# EAGLE schematic Kord Kontroller PCB 0.1 (EAGLE 9.2.2)

## Sheet 1 of 2
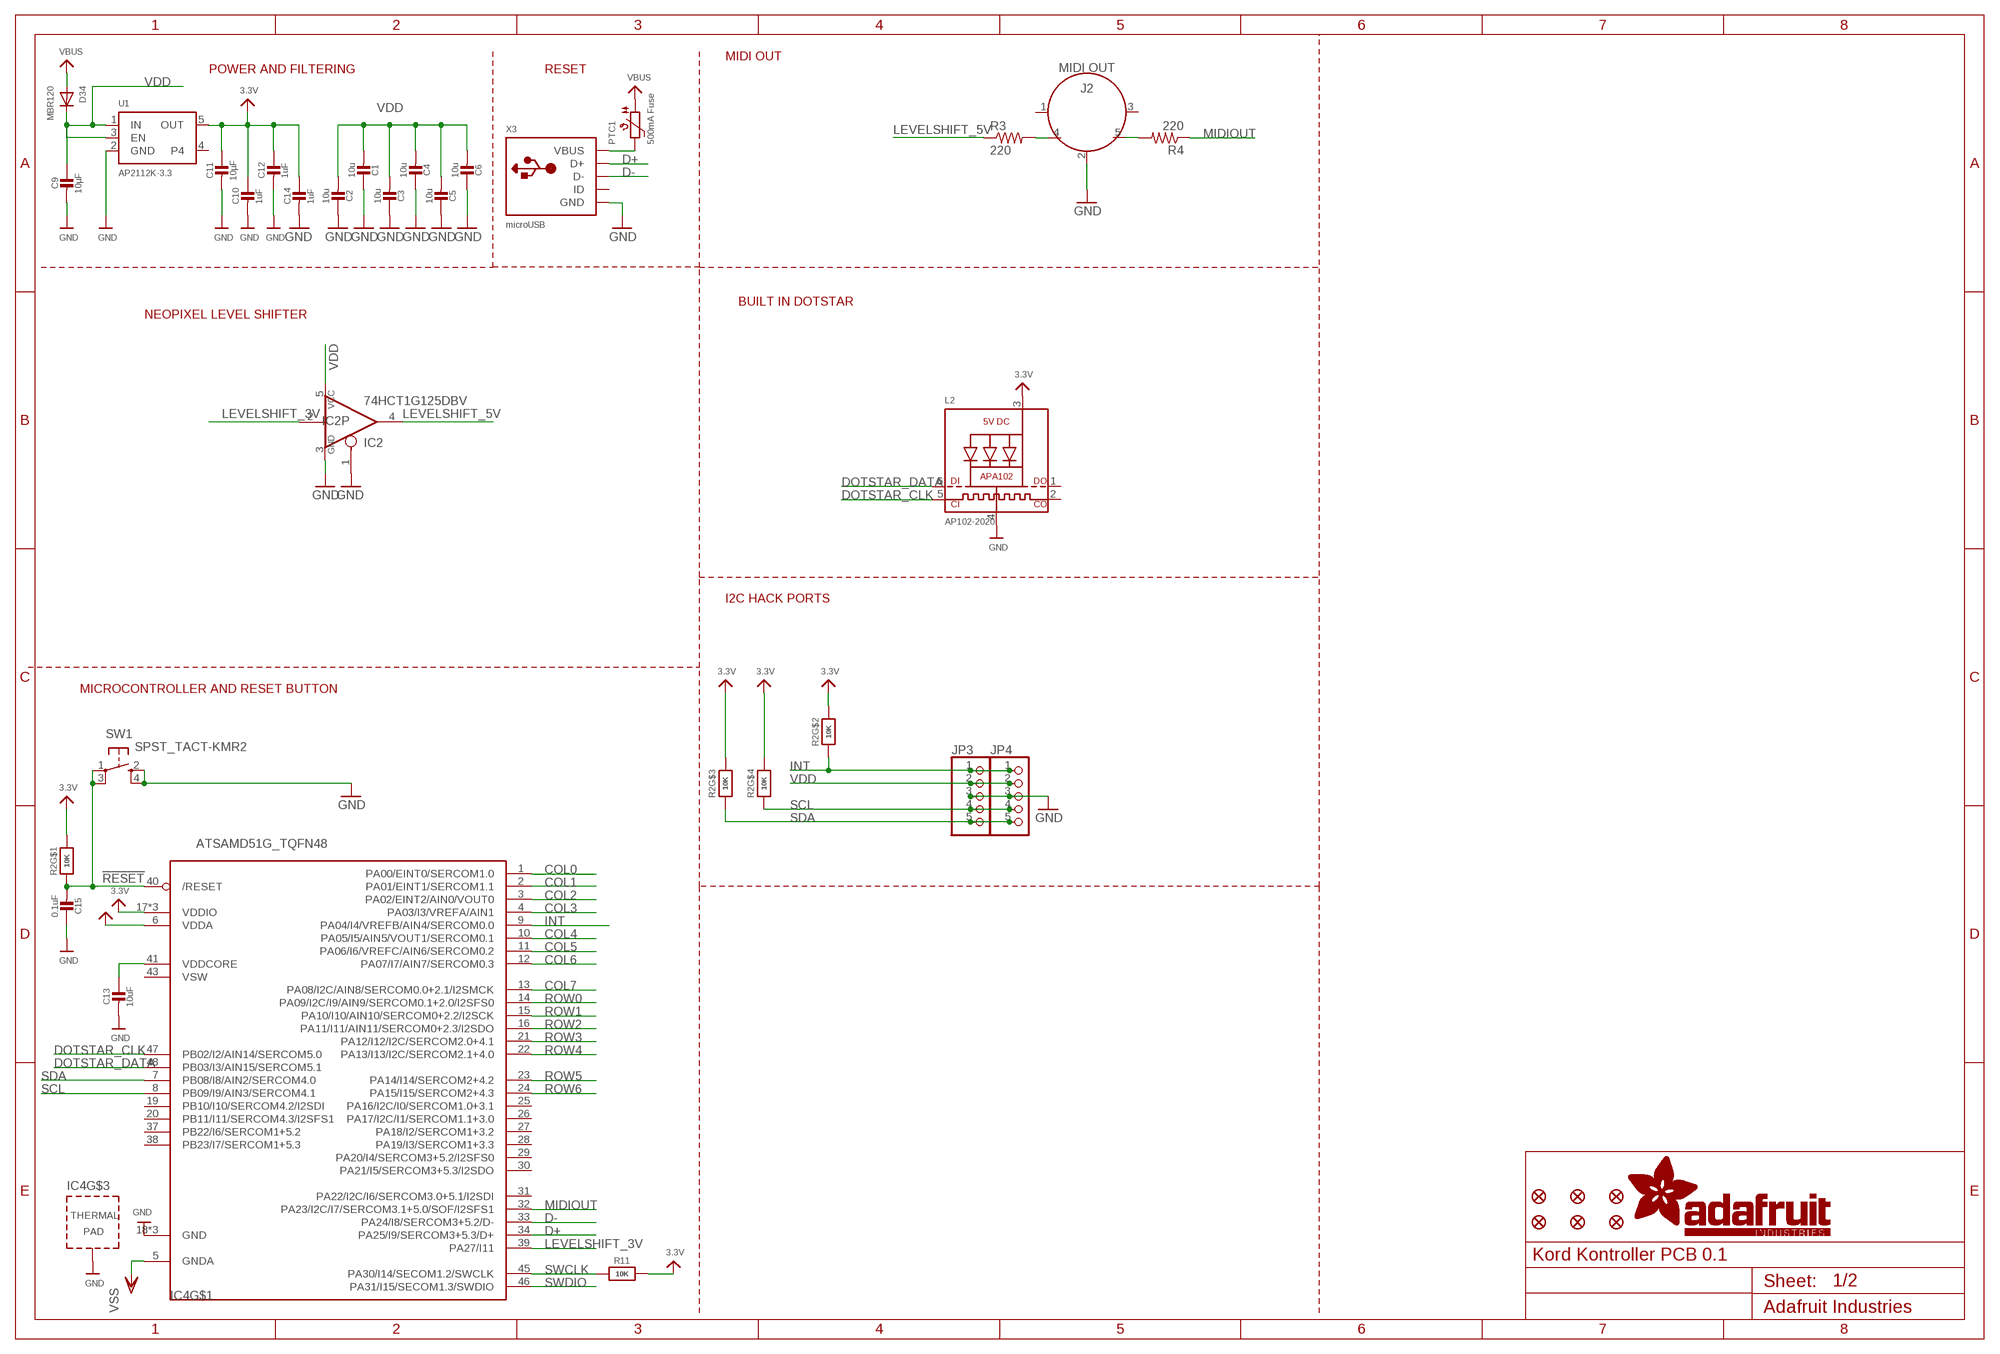
[diagram p0: schematic, sheet 1]

### Parts
C1  10u  CAP_CERAMIC0805-NOOUTLINE  [0805-NO]
C2  10u  CAP_CERAMIC0805-NOOUTLINE  [0805-NO]
C3  10u  CAP_CERAMIC0805-NOOUTLINE  [0805-NO]
C4  10u  CAP_CERAMIC0805-NOOUTLINE  [0805-NO]
C5  10u  CAP_CERAMIC0805-NOOUTLINE  [0805-NO]
C6  10u  CAP_CERAMIC0805-NOOUTLINE  [0805-NO]
C9  10µF  CAP_CERAMIC0805-NOOUTLINE  [0805-NO]
C10  1uF  CAP_CERAMIC0603_NO  [0603-NO]
C11  10µF  CAP_CERAMIC0805-NOOUTLINE  [0805-NO]
C12  1uF  CAP_CERAMIC0603_NO  [0603-NO]
C13  10uF  CAP_CERAMIC0805-NOOUTLINE  [0805-NO]
C14  1uF  CAP_CERAMIC0603_NO  [0603-NO]
C15  0.1uF  CAP_CERAMIC0603_NO  [0603-NO]
D34  MBR120  DIODE_SOD-123FL  [SOD-123FL]
FID1  FIDUCIAL_1MM  [FIDUCIAL_1MM]
FID2  FIDUCIAL_1MM  [FIDUCIAL_1MM]
FID3  FIDUCIAL_1MM  [FIDUCIAL_1MM]
FID4  FIDUCIAL_1MM  [FIDUCIAL_1MM]
FID5  FIDUCIAL_1MM  [FIDUCIAL_1MM]
FID6  FIDUCIAL_1MM  [FIDUCIAL_1MM]
IC2  74HCT1G125DBV  74AHC1G125DBV  [SOT23-5]
IC4  ATSAMD51G_TQFN48  [TQFN48_7MM]
J2  MIDI OUT  5-PIN-CIRCULAR-DINNEW  [5-PIN-DIN-RA-PCB-NEW]
JP3  HEADER-1X5EDGESMT  [5P_EDGECONNECT]
JP4  HEADER-1X5EDGESMT  [5P_EDGECONNECT]
L2  AP102-2020  APA1022020  [APA102_2020]
PTC1  500mA Fuse  PTC1206  [1206]
R2  10K  RESISTOR_4PACK  [RESPACK_4X0603]
R3  220  220OHM-1/10W-1%(0603)  [0603-RES]
R4  220  220OHM-1/10W-1%(0603)  [0603-RES]
R11  10K  RESISTOR_0603_NOOUT  [0603-NO]
SW1  SPST_TACT-KMR2  [KMR2]
U1  AP2112K-3.3  VREG_SOT23-5  [SOT23-5]
X3  microUSB  USB_MICRO_NARROW  [4UCONN_20329_NARROW]

### Nets
3.3V: C10.1 C11.1 C12.1 C14.1 IC4.17(VDDIO) IC4.36(VDDIO) IC4.44(VDDIO) L2.3(VDD) R2.5 R2.6 R2.7 R2.8 R11.2 U1.5(OUT)
!RESET: C15.2 IC4.40(/RESET) R2.1 SW1.1(P) SW1.3(P1)
AVDD: IC4.6(VDDA)
COL0: IC4.1(PA00/EINT0/SERCOM1.0) ; also sheet 2
COL1: IC4.2(PA01/EINT1/SERCOM1.1) ; also sheet 2
COL2: IC4.3(PA02/EINT2/AIN0/VOUT0) ; also sheet 2
COL3: IC4.4(PA03/I3/VREFA/AIN1) ; also sheet 2
COL4: IC4.10(PA05/I5/AIN5/VOUT1/SERCOM0.1) ; also sheet 2
COL5: IC4.11(PA06/I6/VREFC/AIN6/SERCOM0.2) ; also sheet 2
COL6: IC4.12(PA07/I7/AIN7/SERCOM0.3) ; also sheet 2
COL7: IC4.13(PA08/I2C/AIN8/SERCOM0.0+2.1/I2SMCK) ; also sheet 2
D+: IC4.34(PA25/I9/SERCOM3+5.3/D+) X3.D+
D-: IC4.33(PA24/I8/SERCOM3+5.2/D-) X3.D-
DOTSTAR_CLK: IC4.47(PB02/I2/AIN14/SERCOM5.0) L2.5(CKI)
DOTSTAR_DATA: IC4.48(PB03/I3/AIN15/SERCOM5.1) L2.6(DI)
GND: C1.1 C2.1 C3.1 C4.1 C5.1 C6.1 C9.2 C10.2 C11.2 C12.2 C13.2 C14.2 C15.1 IC2.1(OE) IC2.3(GND) IC4.18(GND) IC4.35(GND) IC4.42(GND) IC4.THERMAL(TP) J2.2 JP3.3 JP4.3 L2.4(GND) SW1.2(S) SW1.4(S1) U1.2(GND) X3.BASE@1(GND) X3.BASE@2(GND) X3.GND X3.SPRT@1(GND) X3.SPRT@2(GND) X3.SPRT@3(GND) X3.SPRT@4(GND) ; also sheet 2
INT: IC4.9(PA04/I4/VREFB/AIN4/SERCOM0.0) JP3.1 JP4.1 R2.2
LEVELSHIFT_3V: IC2.2(I) IC4.39(PA27/I11)
LEVELSHIFT_5V: IC2.4(O) R3.1 ; also sheet 2
MIDIOUT: IC4.32(PA23/I2C/I7/SERCOM3.1+5.0/SOF/I2SFS1) R4.1
N$66: PTC1.2 X3.VBUS
N$110: J2.5 R4.2
N$114: J2.4 R3.2
ROW0: IC4.14(PA09/I2C/I9/AIN9/SERCOM0.1+2.0/I2SFS0) ; also sheet 2
ROW1: IC4.15(PA10/I10/AIN10/SERCOM0+2.2/I2SCK) ; also sheet 2
ROW2: IC4.16(PA11/I11/AIN11/SERCOM0+2.3/I2SDO) ; also sheet 2
ROW3: IC4.21(PA12/I12/I2C/SERCOM2.0+4.1) ; also sheet 2
ROW4: IC4.22(PA13/I13/I2C/SERCOM2.1+4.0) ; also sheet 2
ROW5: IC4.23(PA14/I14/SERCOM2+4.2) ; also sheet 2
ROW6: IC4.24(PA15/I15/SERCOM2+4.3) ; also sheet 2
SCL: IC4.8(PB09/I9/AIN3/SERCOM4.1) JP3.4 JP4.4 R2.4
SDA: IC4.7(PB08/I8/AIN2/SERCOM4.0) JP3.5 JP4.5 R2.3
SWCLK: IC4.45(PA30/I14/SECOM1.2/SWCLK) R11.1
SWDIO: IC4.46(PA31/I15/SECOM1.3/SWDIO)
VBUS: D34.A PTC1.1
VDD [power]: C1.2 C2.2 C3.2 C4.2 C5.2 C6.2 C9.1 D34.C IC2.5(VCC) JP3.2 JP4.2 U1.1(IN) U1.3(EN) ; also sheet 2
VDDCORE: C13.1 IC4.41(VDDCORE)
VSS: IC4.5(GNDA)
Unconnected: IC4.19(PB10/I10/SERCOM4.2/I2SDI) IC4.20(PB11/I11/SERCOM4.3/I2SFS1) IC4.25(PA16/I2C/I0/SERCOM1.0+3.1) IC4.26(PA17/I2C/I1/SERCOM1.1+3.0) IC4.27(PA18/I2/SERCOM1+3.2) IC4.28(PA19/I3/SERCOM1+3.3) IC4.29(PA20/I4/SERCOM3+5.2/I2SFS0) IC4.30(PA21/I5/SERCOM3+5.3/I2SDO) IC4.31(PA22/I2C/I6/SERCOM3.0+5.1/I2SDI) IC4.37(PB22/I6/SERCOM1+5.2) IC4.38(PB23/I7/SERCOM1+5.3) J2.1 J2.3 L2.1(DO) L2.2(CKO) U1.4 X3.ID

### Notes on the sheet
- MIDI OUT
- POWER AND FILTERING | RESET
- BUILT IN DOTSTAR
- NEOPIXEL LEVEL SHIFTER
- I2C HACK PORTS
- MICROCONTROLLER AND RESET BUTTON

## Sheet 2 of 2
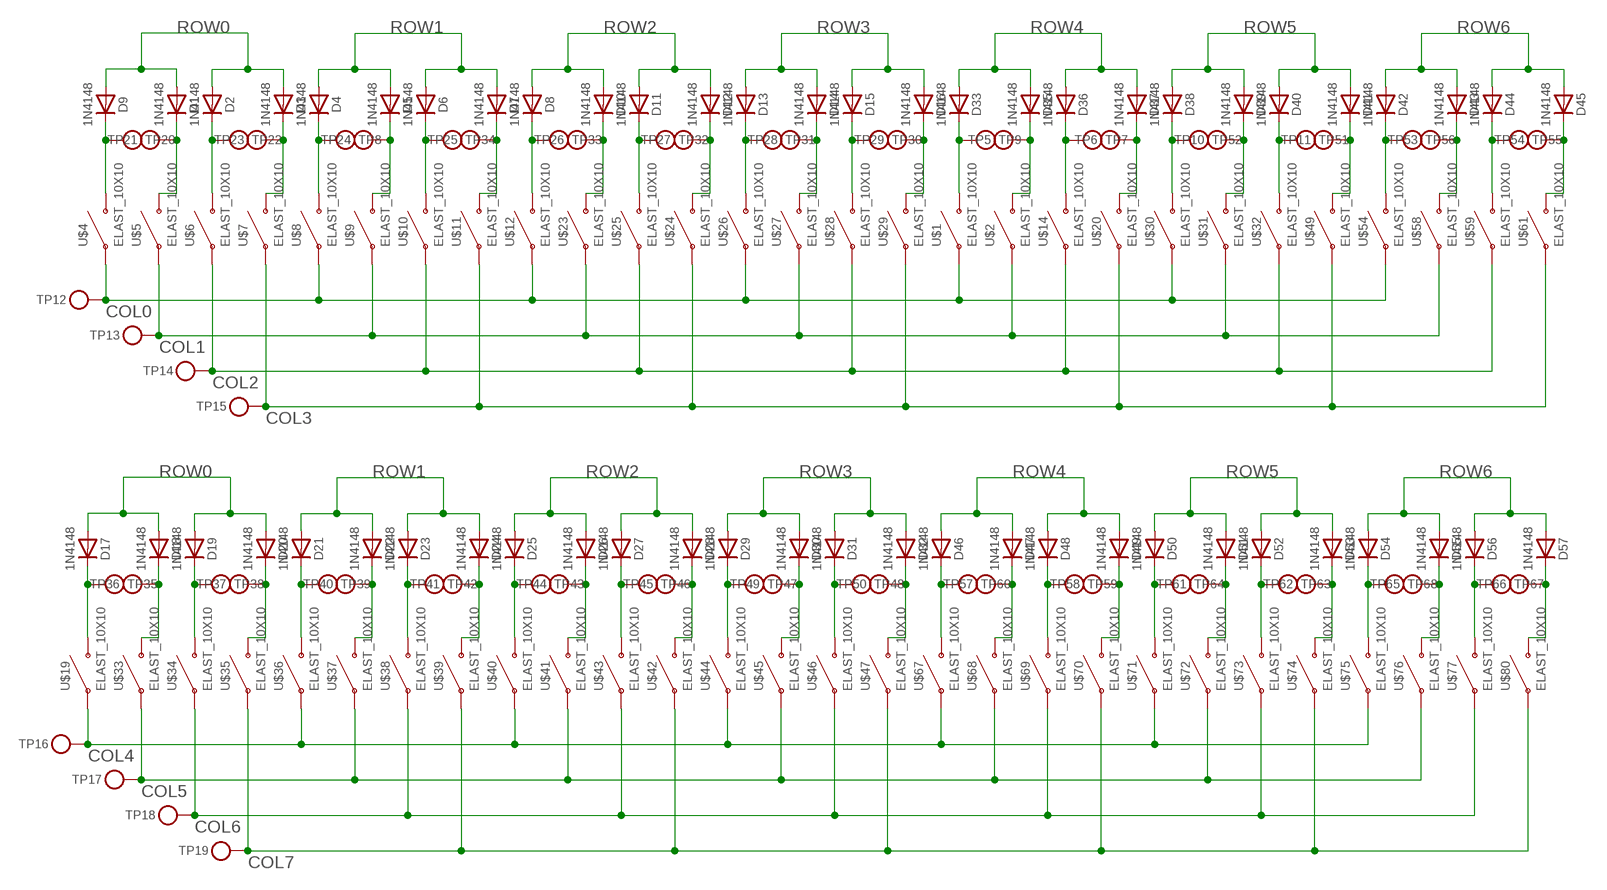
[diagram p1: schematic, sheet 2, part 1 of 2]
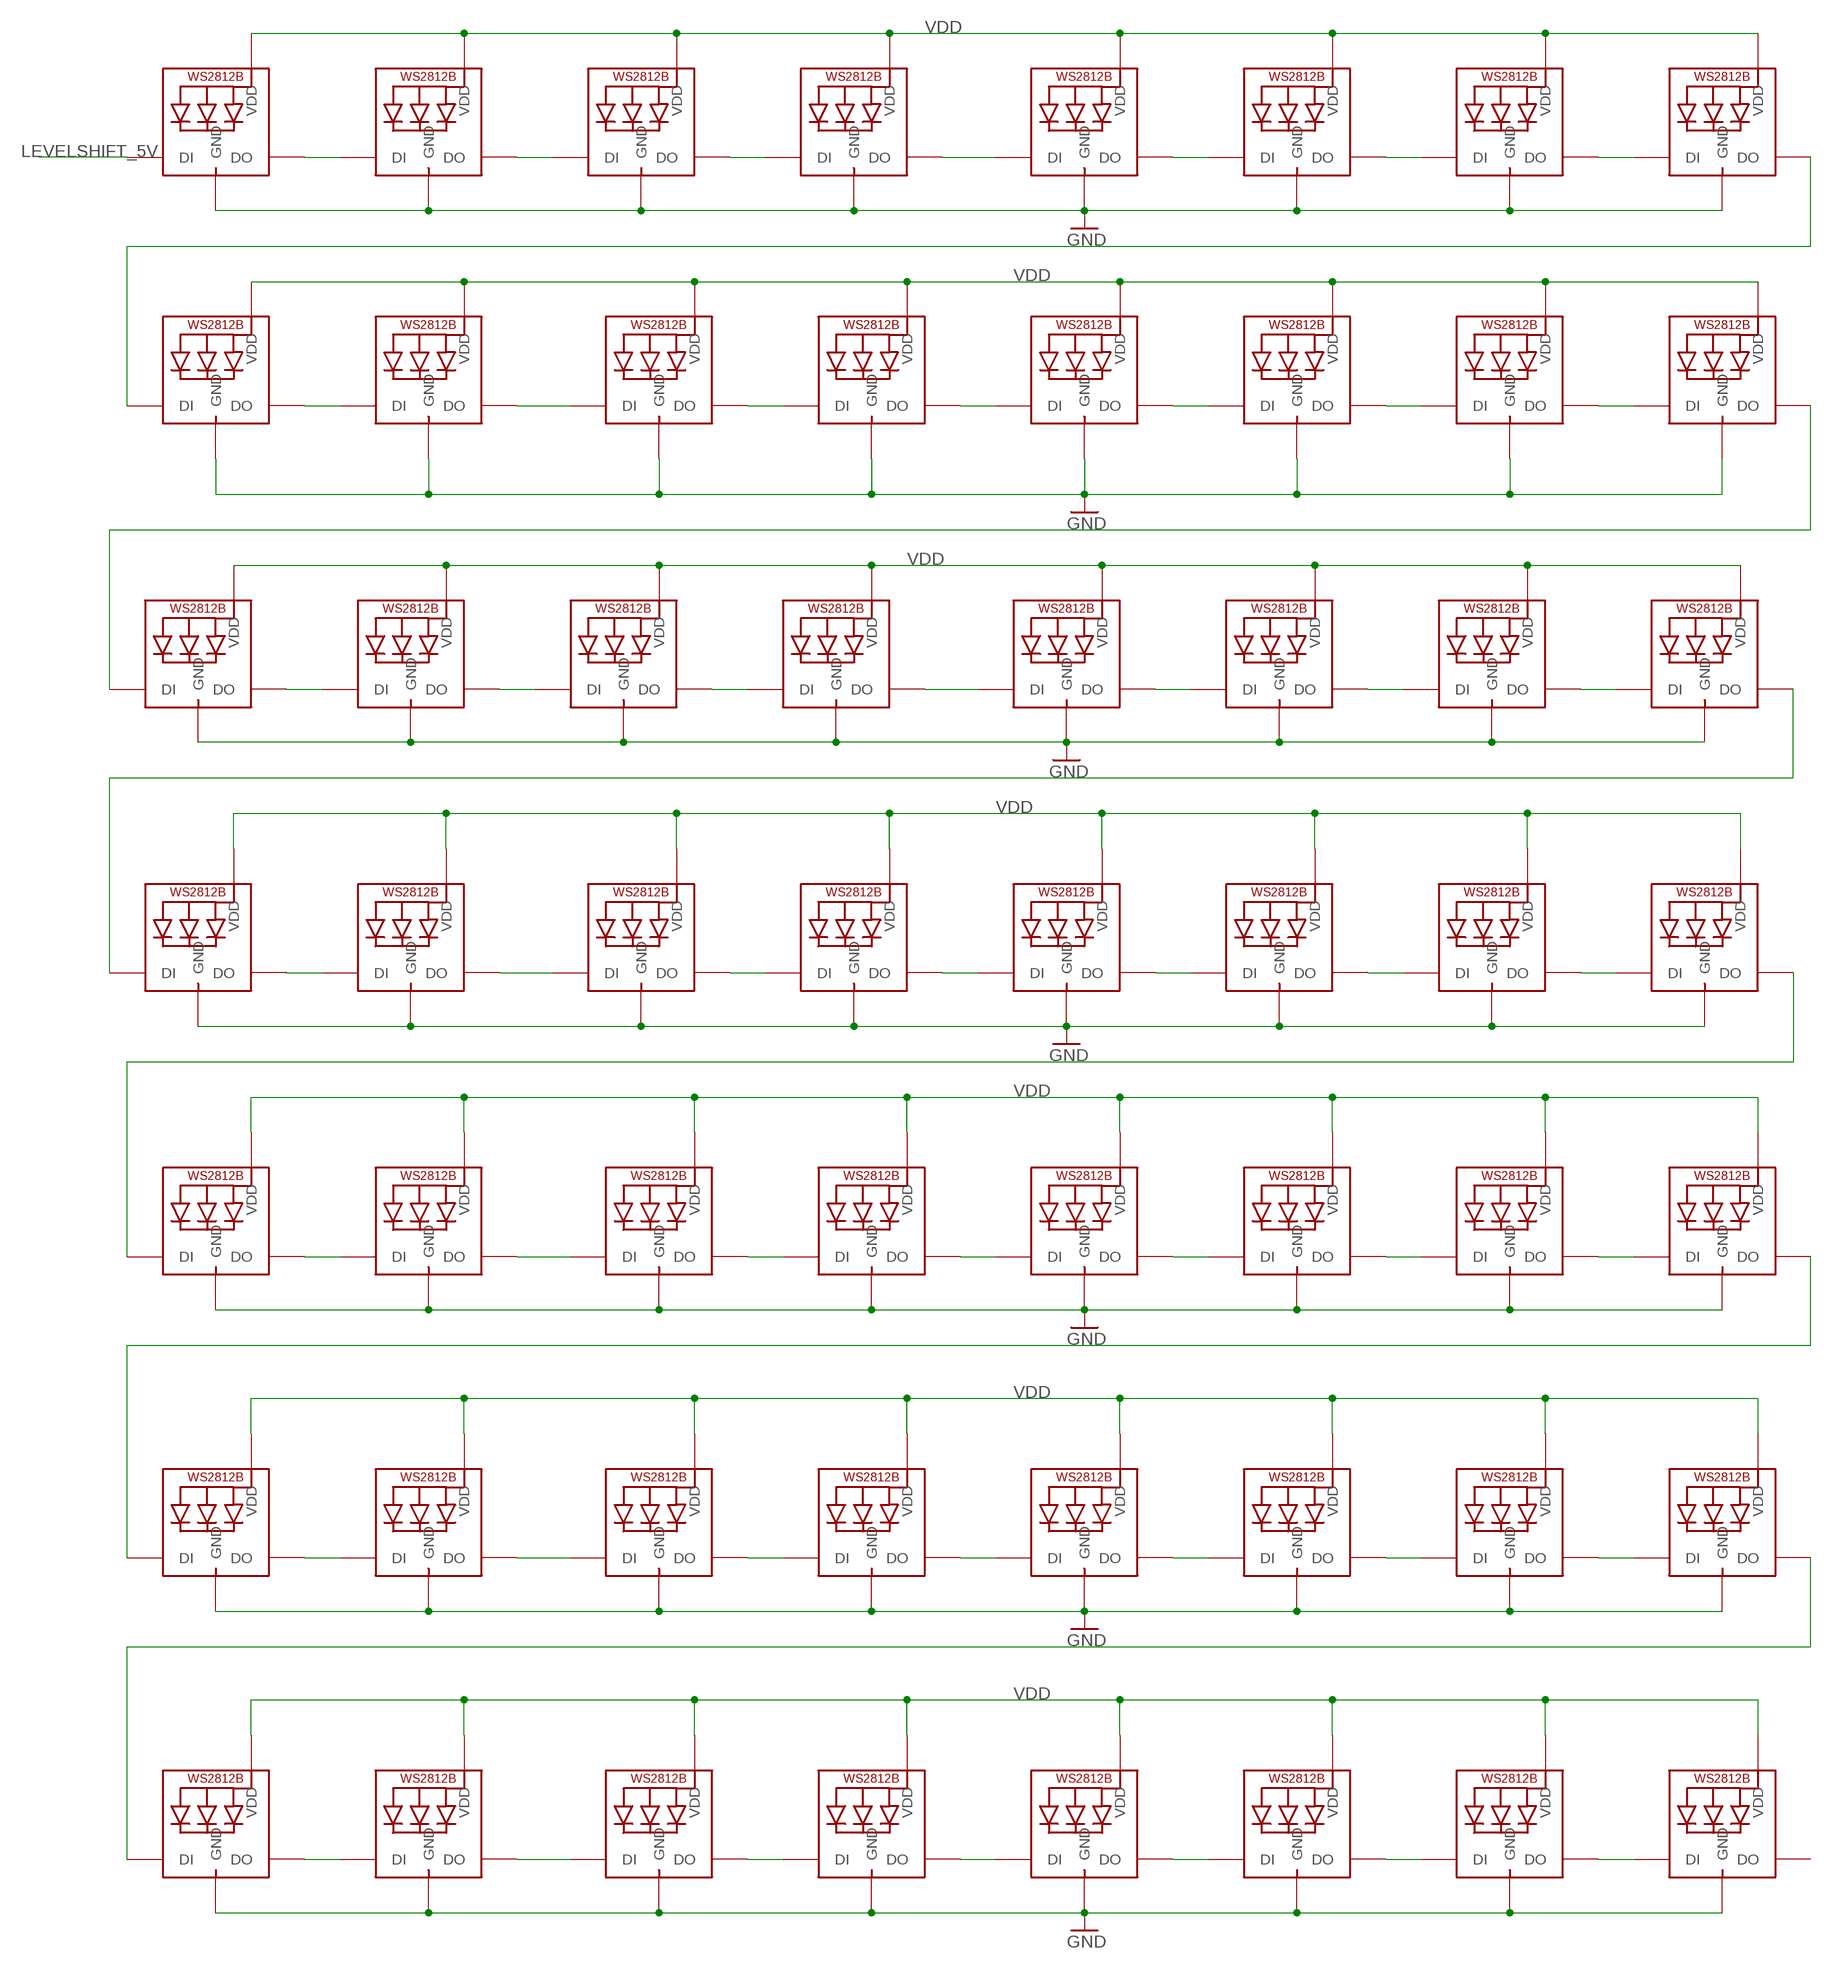
[diagram p2: schematic, sheet 2, part 2 of 2]

### Parts
D1  1N4148  DIODESOD-323  [SOD-323]
D2  1N4148  DIODESOD-323  [SOD-323]
D3  1N4148  DIODESOD-323  [SOD-323]
D4  1N4148  DIODESOD-323  [SOD-323]
D5  1N4148  DIODESOD-323  [SOD-323]
D6  1N4148  DIODESOD-323  [SOD-323]
D7  1N4148  DIODESOD-323  [SOD-323]
D8  1N4148  DIODESOD-323  [SOD-323]
D9  1N4148  DIODESOD-323  [SOD-323]
D10  1N4148  DIODESOD-323  [SOD-323]
D11  1N4148  DIODESOD-323  [SOD-323]
D12  1N4148  DIODESOD-323  [SOD-323]
D13  1N4148  DIODESOD-323  [SOD-323]
D14  1N4148  DIODESOD-323  [SOD-323]
D15  1N4148  DIODESOD-323  [SOD-323]
D16  1N4148  DIODESOD-323  [SOD-323]
D17  1N4148  DIODESOD-323  [SOD-323]
D18  1N4148  DIODESOD-323  [SOD-323]
D19  1N4148  DIODESOD-323  [SOD-323]
D20  1N4148  DIODESOD-323  [SOD-323]
D21  1N4148  DIODESOD-323  [SOD-323]
D22  1N4148  DIODESOD-323  [SOD-323]
D23  1N4148  DIODESOD-323  [SOD-323]
D24  1N4148  DIODESOD-323  [SOD-323]
D25  1N4148  DIODESOD-323  [SOD-323]
D26  1N4148  DIODESOD-323  [SOD-323]
D27  1N4148  DIODESOD-323  [SOD-323]
D28  1N4148  DIODESOD-323  [SOD-323]
D29  1N4148  DIODESOD-323  [SOD-323]
D30  1N4148  DIODESOD-323  [SOD-323]
D31  1N4148  DIODESOD-323  [SOD-323]
D32  1N4148  DIODESOD-323  [SOD-323]
D33  1N4148  DIODESOD-323  [SOD-323]
D35  1N4148  DIODESOD-323  [SOD-323]
D36  1N4148  DIODESOD-323  [SOD-323]
D37  1N4148  DIODESOD-323  [SOD-323]
D38  1N4148  DIODESOD-323  [SOD-323]
D39  1N4148  DIODESOD-323  [SOD-323]
D40  1N4148  DIODESOD-323  [SOD-323]
D41  1N4148  DIODESOD-323  [SOD-323]
D42  1N4148  DIODESOD-323  [SOD-323]
D43  1N4148  DIODESOD-323  [SOD-323]
D44  1N4148  DIODESOD-323  [SOD-323]
D45  1N4148  DIODESOD-323  [SOD-323]
D46  1N4148  DIODESOD-323  [SOD-323]
D47  1N4148  DIODESOD-323  [SOD-323]
D48  1N4148  DIODESOD-323  [SOD-323]
D49  1N4148  DIODESOD-323  [SOD-323]
D50  1N4148  DIODESOD-323  [SOD-323]
D51  1N4148  DIODESOD-323  [SOD-323]
D52  1N4148  DIODESOD-323  [SOD-323]
D53  1N4148  DIODESOD-323  [SOD-323]
D54  1N4148  DIODESOD-323  [SOD-323]
D55  1N4148  DIODESOD-323  [SOD-323]
D56  1N4148  DIODESOD-323  [SOD-323]
D57  1N4148  DIODESOD-323  [SOD-323]
LED1  WS2812B3535  [LED3535]
LED2  WS2812B3535  [LED3535]
LED3  WS2812B3535  [LED3535]
LED4  WS2812B3535  [LED3535]
LED5  WS2812B3535  [LED3535]
LED6  WS2812B3535  [LED3535]
LED7  WS2812B3535  [LED3535]
LED8  WS2812B3535  [LED3535]
LED9  WS2812B3535  [LED3535]
LED10  WS2812B3535  [LED3535]
LED11  WS2812B3535  [LED3535]
LED12  WS2812B3535  [LED3535]
LED13  WS2812B3535  [LED3535]
LED14  WS2812B3535  [LED3535]
LED15  WS2812B3535  [LED3535]
LED16  WS2812B3535  [LED3535]
LED17  WS2812B3535  [LED3535]
LED18  WS2812B3535  [LED3535]
LED19  WS2812B3535  [LED3535]
LED20  WS2812B3535  [LED3535]
LED21  WS2812B3535  [LED3535]
LED22  WS2812B3535  [LED3535]
LED23  WS2812B3535  [LED3535]
LED24  WS2812B3535  [LED3535]
LED25  WS2812B3535  [LED3535]
LED26  WS2812B3535  [LED3535]
LED27  WS2812B3535  [LED3535]
LED28  WS2812B3535  [LED3535]
LED29  WS2812B3535  [LED3535]
LED30  WS2812B3535  [LED3535]
LED31  WS2812B3535  [LED3535]
LED32  WS2812B3535  [LED3535]
LED33  WS2812B3535  [LED3535]
LED34  WS2812B3535  [LED3535]
LED35  WS2812B3535  [LED3535]
LED36  WS2812B3535  [LED3535]
LED37  WS2812B3535  [LED3535]
LED38  WS2812B3535  [LED3535]
LED39  WS2812B3535  [LED3535]
LED40  WS2812B3535  [LED3535]
LED41  WS2812B3535  [LED3535]
LED42  WS2812B3535  [LED3535]
LED43  WS2812B3535  [LED3535]
LED44  WS2812B3535  [LED3535]
LED45  WS2812B3535  [LED3535]
LED46  WS2812B3535  [LED3535]
LED47  WS2812B3535  [LED3535]
LED48  WS2812B3535  [LED3535]
LED49  WS2812B3535  [LED3535]
LED50  WS2812B3535  [LED3535]
LED51  WS2812B3535  [LED3535]
LED52  WS2812B3535  [LED3535]
LED53  WS2812B3535  [LED3535]
LED54  WS2812B3535  [LED3535]
LED55  WS2812B3535  [LED3535]
LED56  WS2812B3535  [LED3535]
TP5  TESTPOINTROUND1.5MM  [TESTPOINT_ROUND_1.5MM]
TP6  TESTPOINTROUND1.5MM  [TESTPOINT_ROUND_1.5MM]
TP7  TESTPOINTROUND1.5MM  [TESTPOINT_ROUND_1.5MM]
TP8  TESTPOINTROUND1.5MM  [TESTPOINT_ROUND_1.5MM]
TP9  TESTPOINTROUND1.5MM  [TESTPOINT_ROUND_1.5MM]
TP10  TESTPOINTROUND1.5MM  [TESTPOINT_ROUND_1.5MM]
TP11  TESTPOINTROUND1.5MM  [TESTPOINT_ROUND_1.5MM]
TP12  TESTPOINTROUND1.5MM  [TESTPOINT_ROUND_1.5MM]
TP13  TESTPOINTROUND1.5MM  [TESTPOINT_ROUND_1.5MM]
TP14  TESTPOINTROUND1.5MM  [TESTPOINT_ROUND_1.5MM]
TP15  TESTPOINTROUND1.5MM  [TESTPOINT_ROUND_1.5MM]
TP16  TESTPOINTROUND1.5MM  [TESTPOINT_ROUND_1.5MM]
TP17  TESTPOINTROUND1.5MM  [TESTPOINT_ROUND_1.5MM]
TP18  TESTPOINTROUND1.5MM  [TESTPOINT_ROUND_1.5MM]
TP19  TESTPOINTROUND1.5MM  [TESTPOINT_ROUND_1.5MM]
TP20  TESTPOINTROUND1.5MM  [TESTPOINT_ROUND_1.5MM]
TP21  TESTPOINTROUND1.5MM  [TESTPOINT_ROUND_1.5MM]
TP22  TESTPOINTROUND1.5MM  [TESTPOINT_ROUND_1.5MM]
TP23  TESTPOINTROUND1.5MM  [TESTPOINT_ROUND_1.5MM]
TP24  TESTPOINTROUND1.5MM  [TESTPOINT_ROUND_1.5MM]
TP25  TESTPOINTROUND1.5MM  [TESTPOINT_ROUND_1.5MM]
TP26  TESTPOINTROUND1.5MM  [TESTPOINT_ROUND_1.5MM]
TP27  TESTPOINTROUND1.5MM  [TESTPOINT_ROUND_1.5MM]
TP28  TESTPOINTROUND1.5MM  [TESTPOINT_ROUND_1.5MM]
TP29  TESTPOINTROUND1.5MM  [TESTPOINT_ROUND_1.5MM]
TP30  TESTPOINTROUND1.5MM  [TESTPOINT_ROUND_1.5MM]
TP31  TESTPOINTROUND1.5MM  [TESTPOINT_ROUND_1.5MM]
TP32  TESTPOINTROUND1.5MM  [TESTPOINT_ROUND_1.5MM]
TP33  TESTPOINTROUND1.5MM  [TESTPOINT_ROUND_1.5MM]
TP34  TESTPOINTROUND1.5MM  [TESTPOINT_ROUND_1.5MM]
TP35  TESTPOINTROUND1.5MM  [TESTPOINT_ROUND_1.5MM]
TP36  TESTPOINTROUND1.5MM  [TESTPOINT_ROUND_1.5MM]
TP37  TESTPOINTROUND1.5MM  [TESTPOINT_ROUND_1.5MM]
TP38  TESTPOINTROUND1.5MM  [TESTPOINT_ROUND_1.5MM]
TP39  TESTPOINTROUND1.5MM  [TESTPOINT_ROUND_1.5MM]
TP40  TESTPOINTROUND1.5MM  [TESTPOINT_ROUND_1.5MM]
TP41  TESTPOINTROUND1.5MM  [TESTPOINT_ROUND_1.5MM]
TP42  TESTPOINTROUND1.5MM  [TESTPOINT_ROUND_1.5MM]
TP43  TESTPOINTROUND1.5MM  [TESTPOINT_ROUND_1.5MM]
TP44  TESTPOINTROUND1.5MM  [TESTPOINT_ROUND_1.5MM]
TP45  TESTPOINTROUND1.5MM  [TESTPOINT_ROUND_1.5MM]
TP46  TESTPOINTROUND1.5MM  [TESTPOINT_ROUND_1.5MM]
TP47  TESTPOINTROUND1.5MM  [TESTPOINT_ROUND_1.5MM]
TP48  TESTPOINTROUND1.5MM  [TESTPOINT_ROUND_1.5MM]
TP49  TESTPOINTROUND1.5MM  [TESTPOINT_ROUND_1.5MM]
TP50  TESTPOINTROUND1.5MM  [TESTPOINT_ROUND_1.5MM]
TP51  TESTPOINTROUND1.5MM  [TESTPOINT_ROUND_1.5MM]
TP52  TESTPOINTROUND1.5MM  [TESTPOINT_ROUND_1.5MM]
TP53  TESTPOINTROUND1.5MM  [TESTPOINT_ROUND_1.5MM]
TP54  TESTPOINTROUND1.5MM  [TESTPOINT_ROUND_1.5MM]
TP55  TESTPOINTROUND1.5MM  [TESTPOINT_ROUND_1.5MM]
TP56  TESTPOINTROUND1.5MM  [TESTPOINT_ROUND_1.5MM]
TP57  TESTPOINTROUND1.5MM  [TESTPOINT_ROUND_1.5MM]
TP58  TESTPOINTROUND1.5MM  [TESTPOINT_ROUND_1.5MM]
TP59  TESTPOINTROUND1.5MM  [TESTPOINT_ROUND_1.5MM]
TP60  TESTPOINTROUND1.5MM  [TESTPOINT_ROUND_1.5MM]
TP61  TESTPOINTROUND1.5MM  [TESTPOINT_ROUND_1.5MM]
TP62  TESTPOINTROUND1.5MM  [TESTPOINT_ROUND_1.5MM]
TP63  TESTPOINTROUND1.5MM  [TESTPOINT_ROUND_1.5MM]
TP64  TESTPOINTROUND1.5MM  [TESTPOINT_ROUND_1.5MM]
TP65  TESTPOINTROUND1.5MM  [TESTPOINT_ROUND_1.5MM]
TP66  TESTPOINTROUND1.5MM  [TESTPOINT_ROUND_1.5MM]
TP67  TESTPOINTROUND1.5MM  [TESTPOINT_ROUND_1.5MM]
TP68  TESTPOINTROUND1.5MM  [TESTPOINT_ROUND_1.5MM]
U$1  ELAST_10X10  [ELAST_PAD_SQUARE_10MM_4X4WIDE]
U$2  ELAST_10X10  [ELAST_PAD_SQUARE_10MM_4X4WIDE]
U$4  ELAST_10X10  [ELAST_PAD_SQUARE_10MM_4X4WIDE]
U$5  ELAST_10X10  [ELAST_PAD_SQUARE_10MM_4X4WIDE]
U$6  ELAST_10X10  [ELAST_PAD_SQUARE_10MM_4X4WIDE]
U$7  ELAST_10X10  [ELAST_PAD_SQUARE_10MM_4X4WIDE]
U$8  ELAST_10X10  [ELAST_PAD_SQUARE_10MM_4X4WIDE]
U$9  ELAST_10X10  [ELAST_PAD_SQUARE_10MM_4X4WIDE]
U$10  ELAST_10X10  [ELAST_PAD_SQUARE_10MM_4X4WIDE]
U$11  ELAST_10X10  [ELAST_PAD_SQUARE_10MM_4X4WIDE]
U$12  ELAST_10X10  [ELAST_PAD_SQUARE_10MM_4X4WIDE]
U$14  ELAST_10X10  [ELAST_PAD_SQUARE_10MM_4X4WIDE]
U$19  ELAST_10X10  [ELAST_PAD_SQUARE_10MM_4X4WIDE]
U$20  ELAST_10X10  [ELAST_PAD_SQUARE_10MM_4X4WIDE]
U$23  ELAST_10X10  [ELAST_PAD_SQUARE_10MM_4X4WIDE]
U$24  ELAST_10X10  [ELAST_PAD_SQUARE_10MM_4X4WIDE]
U$25  ELAST_10X10  [ELAST_PAD_SQUARE_10MM_4X4WIDE]
U$26  ELAST_10X10  [ELAST_PAD_SQUARE_10MM_4X4WIDE]
U$27  ELAST_10X10  [ELAST_PAD_SQUARE_10MM_4X4WIDE]
U$28  ELAST_10X10  [ELAST_PAD_SQUARE_10MM_4X4WIDE]
U$29  ELAST_10X10  [ELAST_PAD_SQUARE_10MM_4X4WIDE]
U$30  ELAST_10X10  [ELAST_PAD_SQUARE_10MM_4X4WIDE]
U$31  ELAST_10X10  [ELAST_PAD_SQUARE_10MM_4X4WIDE]
U$32  ELAST_10X10  [ELAST_PAD_SQUARE_10MM_4X4WIDE]
U$33  ELAST_10X10  [ELAST_PAD_SQUARE_10MM_4X4WIDE]
U$34  ELAST_10X10  [ELAST_PAD_SQUARE_10MM_4X4WIDE]
U$35  ELAST_10X10  [ELAST_PAD_SQUARE_10MM_4X4WIDE]
U$36  ELAST_10X10  [ELAST_PAD_SQUARE_10MM_4X4WIDE]
U$37  ELAST_10X10  [ELAST_PAD_SQUARE_10MM_4X4WIDE]
U$38  ELAST_10X10  [ELAST_PAD_SQUARE_10MM_4X4WIDE]
U$39  ELAST_10X10  [ELAST_PAD_SQUARE_10MM_4X4WIDE]
U$40  ELAST_10X10  [ELAST_PAD_SQUARE_10MM_4X4WIDE]
U$41  ELAST_10X10  [ELAST_PAD_SQUARE_10MM_4X4WIDE]
U$42  ELAST_10X10  [ELAST_PAD_SQUARE_10MM_4X4WIDE]
U$43  ELAST_10X10  [ELAST_PAD_SQUARE_10MM_4X4WIDE]
U$44  ELAST_10X10  [ELAST_PAD_SQUARE_10MM_4X4WIDE]
U$45  ELAST_10X10  [ELAST_PAD_SQUARE_10MM_4X4WIDE]
U$46  ELAST_10X10  [ELAST_PAD_SQUARE_10MM_4X4WIDE]
U$47  ELAST_10X10  [ELAST_PAD_SQUARE_10MM_4X4WIDE]
U$49  ELAST_10X10  [ELAST_PAD_SQUARE_10MM_4X4WIDE]
U$54  ELAST_10X10  [ELAST_PAD_SQUARE_10MM_4X4WIDE]
U$58  ELAST_10X10  [ELAST_PAD_SQUARE_10MM_4X4WIDE]
U$59  ELAST_10X10  [ELAST_PAD_SQUARE_10MM_4X4WIDE]
U$61  ELAST_10X10  [ELAST_PAD_SQUARE_10MM_4X4WIDE]
U$67  ELAST_10X10  [ELAST_PAD_SQUARE_10MM_4X4WIDE]
U$68  ELAST_10X10  [ELAST_PAD_SQUARE_10MM_4X4WIDE]
U$69  ELAST_10X10  [ELAST_PAD_SQUARE_10MM_4X4WIDE]
U$70  ELAST_10X10  [ELAST_PAD_SQUARE_10MM_4X4WIDE]
U$71  ELAST_10X10  [ELAST_PAD_SQUARE_10MM_4X4WIDE]
U$72  ELAST_10X10  [ELAST_PAD_SQUARE_10MM_4X4WIDE]
U$73  ELAST_10X10  [ELAST_PAD_SQUARE_10MM_4X4WIDE]
U$74  ELAST_10X10  [ELAST_PAD_SQUARE_10MM_4X4WIDE]
U$75  ELAST_10X10  [ELAST_PAD_SQUARE_10MM_4X4WIDE]
U$76  ELAST_10X10  [ELAST_PAD_SQUARE_10MM_4X4WIDE]
U$77  ELAST_10X10  [ELAST_PAD_SQUARE_10MM_4X4WIDE]
U$80  ELAST_10X10  [ELAST_PAD_SQUARE_10MM_4X4WIDE]

### Nets
COL0: TP12.P$1 U$1.P$1 U$4.P$1 U$8.P$1 U$12.P$1 U$26.P$1 U$30.P$1 U$54.P$1 ; also sheet 1
COL1: TP13.P$1 U$2.P$1 U$5.P$1 U$9.P$1 U$23.P$1 U$27.P$1 U$31.P$1 U$58.P$1 ; also sheet 1
COL2: TP14.P$1 U$6.P$1 U$10.P$1 U$14.P$1 U$25.P$1 U$28.P$1 U$32.P$1 U$59.P$1 ; also sheet 1
COL3: TP15.P$1 U$7.P$1 U$11.P$1 U$20.P$1 U$24.P$1 U$29.P$1 U$49.P$1 U$61.P$1 ; also sheet 1
COL4: TP16.P$1 U$19.P$1 U$36.P$1 U$40.P$1 U$44.P$1 U$67.P$1 U$71.P$1 U$75.P$1 ; also sheet 1
COL5: TP17.P$1 U$33.P$1 U$37.P$1 U$41.P$1 U$45.P$1 U$68.P$1 U$72.P$1 U$76.P$1 ; also sheet 1
COL6: TP18.P$1 U$34.P$1 U$38.P$1 U$43.P$1 U$46.P$1 U$69.P$1 U$73.P$1 U$77.P$1 ; also sheet 1
COL7: TP19.P$1 U$35.P$1 U$39.P$1 U$42.P$1 U$47.P$1 U$70.P$1 U$74.P$1 U$80.P$1 ; also sheet 1
GND: LED1.4(GND) LED2.4(GND) LED3.4(GND) LED4.4(GND) LED5.4(GND) LED6.4(GND) LED7.4(GND) LED8.4(GND) LED9.4(GND) LED10.4(GND) LED11.4(GND) LED12.4(GND) LED13.4(GND) LED14.4(GND) LED15.4(GND) LED16.4(GND) LED17.4(GND) LED18.4(GND) LED19.4(GND) LED20.4(GND) LED21.4(GND) LED22.4(GND) LED23.4(GND) LED24.4(GND) LED25.4(GND) LED26.4(GND) LED27.4(GND) LED28.4(GND) LED29.4(GND) LED30.4(GND) LED31.4(GND) LED32.4(GND) LED33.4(GND) LED34.4(GND) LED35.4(GND) LED36.4(GND) LED37.4(GND) LED38.4(GND) LED39.4(GND) LED40.4(GND) LED41.4(GND) LED42.4(GND) LED43.4(GND) LED44.4(GND) LED45.4(GND) LED46.4(GND) LED47.4(GND) LED48.4(GND) LED49.4(GND) LED50.4(GND) LED51.4(GND) LED52.4(GND) LED53.4(GND) LED54.4(GND) LED55.4(GND) LED56.4(GND) ; also sheet 1
LEVELSHIFT_5V: LED1.1(DI) ; also sheet 1
N$1: D33.C TP9.P$1 U$1.P$2
N$2: D9.C TP20.P$1 U$4.P$2
N$3: D1.C TP21.P$1 U$5.P$2
N$4: D2.C TP22.P$1 U$6.P$2
N$5: D3.C TP23.P$1 U$7.P$2
N$6: D4.C TP8.P$1 U$8.P$2
N$7: LED17.3(DO) LED18.1(DI)
N$8: LED18.3(DO) LED19.1(DI)
N$9: D5.C TP24.P$1 U$9.P$2
N$10: LED19.3(DO) LED20.1(DI)
N$11: LED1.3(DO) LED2.1(DI)
N$12: LED2.3(DO) LED3.1(DI)
N$13: LED3.3(DO) LED4.1(DI)
N$14: LED4.3(DO) LED5.1(DI)
N$15: D6.C TP34.P$1 U$10.P$2
N$16: LED5.3(DO) LED6.1(DI)
N$17: LED6.3(DO) LED7.1(DI)
N$18: D7.C TP25.P$1 U$11.P$2
N$19: LED7.3(DO) LED8.1(DI)
N$20: D8.C TP33.P$1 U$12.P$2
N$21: LED8.3(DO) LED9.1(DI)
N$22: D10.C TP26.P$1 U$23.P$2
N$23: D11.C TP32.P$1 U$25.P$2
N$24: D12.C TP27.P$1 U$24.P$2
N$25: D13.C TP31.P$1 U$26.P$2
N$26: D14.C TP28.P$1 U$27.P$2
N$27: D15.C TP30.P$1 U$28.P$2
N$28: D16.C TP29.P$1 U$29.P$2
N$29: LED9.3(DO) LED10.1(DI)
N$30: LED10.3(DO) LED12.1(DI)
N$31: LED11.1(DI) LED12.3(DO)
N$32: LED11.3(DO) LED13.1(DI)
N$33: LED13.3(DO) LED14.1(DI)
N$34: LED14.3(DO) LED15.1(DI)
N$35: LED15.3(DO) LED16.1(DI)
N$36: LED20.3(DO) LED21.1(DI)
N$37: LED21.3(DO) LED22.1(DI)
N$38: LED22.3(DO) LED23.1(DI)
N$39: LED23.3(DO) LED24.1(DI)
N$40: LED24.3(DO) LED25.1(DI)
N$41: LED25.3(DO) LED26.1(DI)
N$42: LED26.3(DO) LED28.1(DI)
N$43: LED27.1(DI) LED28.3(DO)
N$44: LED27.3(DO) LED29.1(DI)
N$45: LED29.3(DO) LED30.1(DI)
N$46: LED30.3(DO) LED31.1(DI)
N$47: LED31.3(DO) LED32.1(DI)
N$48: D17.C TP35.P$1 U$19.P$2
N$49: D18.C TP36.P$1 U$33.P$2
N$50: D19.C TP38.P$1 U$34.P$2
N$51: D20.C TP37.P$1 U$35.P$2
N$52: D21.C TP39.P$1 U$36.P$2
N$53: D22.C TP40.P$1 U$37.P$2
N$54: D23.C TP42.P$1 U$38.P$2
N$55: D24.C TP41.P$1 U$39.P$2
N$56: D25.C TP43.P$1 U$40.P$2
N$57: D26.C TP44.P$1 U$41.P$2
N$58: D27.C TP46.P$1 U$43.P$2
N$59: D28.C TP45.P$1 U$42.P$2
N$60: D29.C TP47.P$1 U$44.P$2
N$61: D30.C TP49.P$1 U$45.P$2
N$62: D31.C TP48.P$1 U$46.P$2
N$63: D32.C TP50.P$1 U$47.P$2
N$64: LED16.3(DO) LED17.1(DI)
N$65: D35.C TP5.P$1 U$2.P$2
N$67: D36.C TP7.P$1 U$14.P$2
N$68: D37.C TP6.P$1 U$20.P$2
N$69: D38.C TP52.P$1 U$30.P$2
N$70: D39.C TP10.P$1 U$31.P$2
N$71: D40.C TP51.P$1 U$32.P$2
N$72: D41.C TP11.P$1 U$49.P$2
N$73: D42.C TP56.P$1 U$54.P$2
N$74: D43.C TP53.P$1 U$58.P$2
N$75: D44.C TP55.P$1 U$59.P$2
N$76: D45.C TP54.P$1 U$61.P$2
N$77: D46.C TP60.P$1 U$67.P$2
N$78: D47.C TP57.P$1 U$68.P$2
N$79: D48.C TP59.P$1 U$69.P$2
N$80: D49.C TP58.P$1 U$70.P$2
N$81: D50.C TP64.P$1 U$71.P$2
N$82: D51.C TP61.P$1 U$72.P$2
N$83: D52.C TP63.P$1 U$73.P$2
N$84: D53.C TP62.P$1 U$74.P$2
N$85: D54.C TP68.P$1 U$75.P$2
N$86: D55.C TP65.P$1 U$76.P$2
N$87: D56.C TP67.P$1 U$77.P$2
N$88: D57.C TP66.P$1 U$80.P$2
N$89: LED33.3(DO) LED34.1(DI)
N$90: LED34.3(DO) LED36.1(DI)
N$91: LED35.1(DI) LED36.3(DO)
N$92: LED35.3(DO) LED37.1(DI)
N$93: LED37.3(DO) LED38.1(DI)
N$94: LED38.3(DO) LED39.1(DI)
N$95: LED39.3(DO) LED40.1(DI)
N$96: LED41.3(DO) LED42.1(DI)
N$97: LED42.3(DO) LED44.1(DI)
N$98: LED43.1(DI) LED44.3(DO)
N$99: LED43.3(DO) LED45.1(DI)
N$100: LED45.3(DO) LED46.1(DI)
N$101: LED46.3(DO) LED47.1(DI)
N$102: LED47.3(DO) LED48.1(DI)
N$103: LED49.3(DO) LED50.1(DI)
N$104: LED50.3(DO) LED52.1(DI)
N$105: LED51.1(DI) LED52.3(DO)
N$106: LED51.3(DO) LED53.1(DI)
N$107: LED53.3(DO) LED54.1(DI)
N$108: LED54.3(DO) LED55.1(DI)
N$109: LED55.3(DO) LED56.1(DI)
N$111: LED40.3(DO) LED41.1(DI)
N$112: LED48.3(DO) LED49.1(DI)
N$113: LED32.3(DO) LED33.1(DI)
ROW0: D1.A D2.A D3.A D9.A D17.A D18.A D19.A D20.A ; also sheet 1
ROW1: D4.A D5.A D6.A D7.A D21.A D22.A D23.A D24.A ; also sheet 1
ROW2: D8.A D10.A D11.A D12.A D25.A D26.A D27.A D28.A ; also sheet 1
ROW3: D13.A D14.A D15.A D16.A D29.A D30.A D31.A D32.A ; also sheet 1
ROW4: D33.A D35.A D36.A D37.A D46.A D47.A D48.A D49.A ; also sheet 1
ROW5: D38.A D39.A D40.A D41.A D50.A D51.A D52.A D53.A ; also sheet 1
ROW6: D42.A D43.A D44.A D45.A D54.A D55.A D56.A D57.A ; also sheet 1
VDD [power]: LED1.2(VDD) LED2.2(VDD) LED3.2(VDD) LED4.2(VDD) LED5.2(VDD) LED6.2(VDD) LED7.2(VDD) LED8.2(VDD) LED9.2(VDD) LED10.2(VDD) LED11.2(VDD) LED12.2(VDD) LED13.2(VDD) LED14.2(VDD) LED15.2(VDD) LED16.2(VDD) LED17.2(VDD) LED18.2(VDD) LED19.2(VDD) LED20.2(VDD) LED21.2(VDD) LED22.2(VDD) LED23.2(VDD) LED24.2(VDD) LED25.2(VDD) LED26.2(VDD) LED27.2(VDD) LED28.2(VDD) LED29.2(VDD) LED30.2(VDD) LED31.2(VDD) LED32.2(VDD) LED33.2(VDD) LED34.2(VDD) LED35.2(VDD) LED36.2(VDD) LED37.2(VDD) LED38.2(VDD) LED39.2(VDD) LED40.2(VDD) LED41.2(VDD) LED42.2(VDD) LED43.2(VDD) LED44.2(VDD) LED45.2(VDD) LED46.2(VDD) LED47.2(VDD) LED48.2(VDD) LED49.2(VDD) LED50.2(VDD) LED51.2(VDD) LED52.2(VDD) LED53.2(VDD) LED54.2(VDD) LED55.2(VDD) LED56.2(VDD) ; also sheet 1
Unconnected: LED56.3(DO)

## Power pins joined to a net without a drawn wire
VSW: IC4.43(VSW)

## Library data of the parts
C1-C6 C9-C15 = microbuilder:CAP_CERAMIC: Ceramic Capacitors For new designs, use the packages preceded by an '_' character since they are more reliable: The following footprints should be used on most boards: _0402 - Standard footprint for regular board layouts _0603 - Standard footprint for regular board layouts _0805 - Standard footprint for regular board layouts _1206 - Standard footprint for regular board layouts For extremely tight-pitch boards where space is at a premium, the following 'micro-pitch' footprints can be used (smaller pads, no silkscreen outline, etc.): _0402MP - Micro-pitch footprint for very dense/compact boards _0603MP - Micro-pitch footprint for very dense/compact boards _0805MP - Micro-pitch footprint for very dense/compact boards _1206MP - Micro-pitch footprint for very dense/compact boards
D1-D33 D35-D57 = microbuilder:DIODE: Diode
D34 = adafruit:DIODE: Diode
FID1-FID6 = microbuilder:FIDUCIAL: Fiducial Alignment Points Various fiducial points for machine vision alignment.; BOM: EXCLUDE
IC2 = 74xx-little-us:74*1G125: Single Bus Buffer Gate with 3-State Output
IC4 = microbuilder:ATSAMD51G
J2 = Testing:5-PIN-CIRCULAR-DIN: 5-pin circular DIN connector. Fillsize variant is frequently used as a MIDI jack; PROD_ID: CONN-09481
JP3 JP4 = microbuilder:HEADER-1X5: PIN HEADER
L2 = microbuilder:APA102: APA102/DotStar Pixels VCC: 5V DC Refresh Rate: 400Hz
LED1-LED56 = microbuilder:WS2812B
PTC1 = microbuilder:PTC: PTC (Resettable Fuse) 1206 Package 250mA PTC (16V Max, Time-to-Trip: 0.08s) - Digikey: F2110CT-ND 1210 Package 100mA PTC (30V Max, Time-to-Trip: 0.6s) - Digikey: MF-USMF010-2CT-ND 1812 Package 750mA PTC (24V Max, Time-to-Trip: 0.2s) - Digikey: MF-MSMF075/24-2CT-ND
R2 = microbuilder:RESISTOR_4PACK: Resistor Packs (4 resistors) 4 x 0603 10K 1/16W - Digikey: YC164J-10KCT-ND
R3 R4 = SparkFun-Resistors:220OHM-1/10W-1%(0603): RES-07861; PROD_ID: RES-07861
R11 = microbuilder:RESISTOR: Resistors For new designs, use the packages preceded by an '_' character since they are more reliable: The following footprints should be used on most boards: _0402 - Standard footprint for regular board layouts _0603 - Standard footprint for regular board layouts _0805 - Standard footprint for regular board layouts _1206 - Standard footprint for regular board layouts For extremely tight-pitch boards where space is at a premium, the following 'micro-pitch' footprints can be used (smaller pads, no silkscreen outline, etc.): _0402MP - Micro-pitch footprint for very dense/compact boards _0603MP - Micro-pitch footprint for very dense/compact boards _0805MP - Micro-pitch footprint for very dense/compact boards _1206MP - Micro-pitch footprint for very dense/compact boards
SW1 = adafruit:SPST_TACT: SMT 6mm switch, EVQQ2 series http://www.ladyada.net/library/eagle
TP5-TP68 = microbuilder:TESTPOINT: Test Point Various test points for characterisation and PCB testing TESTPOINT_SMT - Compact Surface Mount Test Point [Digikey: 5016KTR-ND]
U1 = microbuilder:VREG_SOT23-5: SOT23-5 Fixed Voltage Regulators Part Current Out V Out V In V Dropout θJA (°C/W) TJ (°C) Digikey Part No. ADP121 150mA 3.3V 3.4-5.5V 0.09V @ 150mA -- -- ADP121-AUJZ33R7CT-ND ADP121 150mA 3.0V 3.1-5.5V 0.09V @ 150mA -- -- ADP121-AUJZ30R7CT-ND ADP122 300mA 3.3V 3.4-5.5V 0.085V @ 300mA -- -- ADP122AUJZ-3.3-R7CT-ND ADP1712 300mA 3.3V 3.5-5.5V 0.17V @ 300mA -- -- ADP1712AUJZ-3.3-R7TR-ND AP7311 (Low Cost) 150mA 3.3V 3.5-6V 0.15V @ 150mA -- -- AP7311-33WG-7DICT-ND LD39015M18R 150mA 1.8V 1.9V-5.5V 0.08V @ 100mA -- -- 497-6977-1-ND LP2985A-33DBVR 150mA 3.3V 3.3-16V 0.28V @ 150mA 206 150 296-18479-1-ND MCP1824T-3302E/OT 300mA 3.3V 3.5V-6V 0.2V @ 300mA -- -- MCP1824T-3302E/OTCT-ND MIC5205-2.5YM5 TR 150mA 2.5V 2.7-16V 0.165V @ 150mA -- -- 576-1257-2-ND MIC5205-3.0YM5 TR 150mA 3.0V 3.2V-16V 0.165V @ 150mA -- -- 576-1258-2-ND MIC5205-3.3YM5 TR 150mA 3.3V 3.5V-16V 0.165V @ 150mA -- -- 576-1259-2-ND TPS780330220 150mA 3.3V+2.2V 3.6-5.5V 250mV Max -- -- 296-23332-1-ND TDA3663/N1,135 100mA 3.3V 3.5-45V 0.18V @ 50mA -- -- 568-5343-1-ND Max operating temp can be calculated using θJA, TJ (max junction temperature), and power in watts. Set the "Maximum Ambient Temperature" until it reaches TJ ("Max Junction Temperature"), which is the absolute limit for safe use of the regulator: Heat Sink Temperature Calculator <http://www.daycounter.com/Calculators/Heat-Sink-Temperature-Calculator.phtml> For example, With 12V source into a 3.3V LP2985 and a 30mA load, we are dissipating (12V-3.3V) * 0.03A = 0.261W. With a θJA of 206 °C/W, a TJ of 150°C, and 261mW we can safely use the chip without a heat sink up to 75°C (=147.1°C Junction Temperature).
U$1 U$2 U$4-U$12 U$14 U$19 U$20 U$23-U$47 U$49 U$54 U$58 U$59 U$61 U$67-U$77 U$80 = microbuilder:ELAST_10X10: 10mm x 10mm elastomer pad
X3 = microbuilder:USB: USB Connectors USBMINIB - Surface Mount Female Mini-B USB Connector 4UConnector: 06564

## Net classes
1 power: width 0.406 mm